# Altium schematic sheet EVK-IRIS-W1-MCULINK_USB_DCDC.SchDoc
size A3; DocumentNumber: 8; SheetNumber: 8; SheetTotal: 14
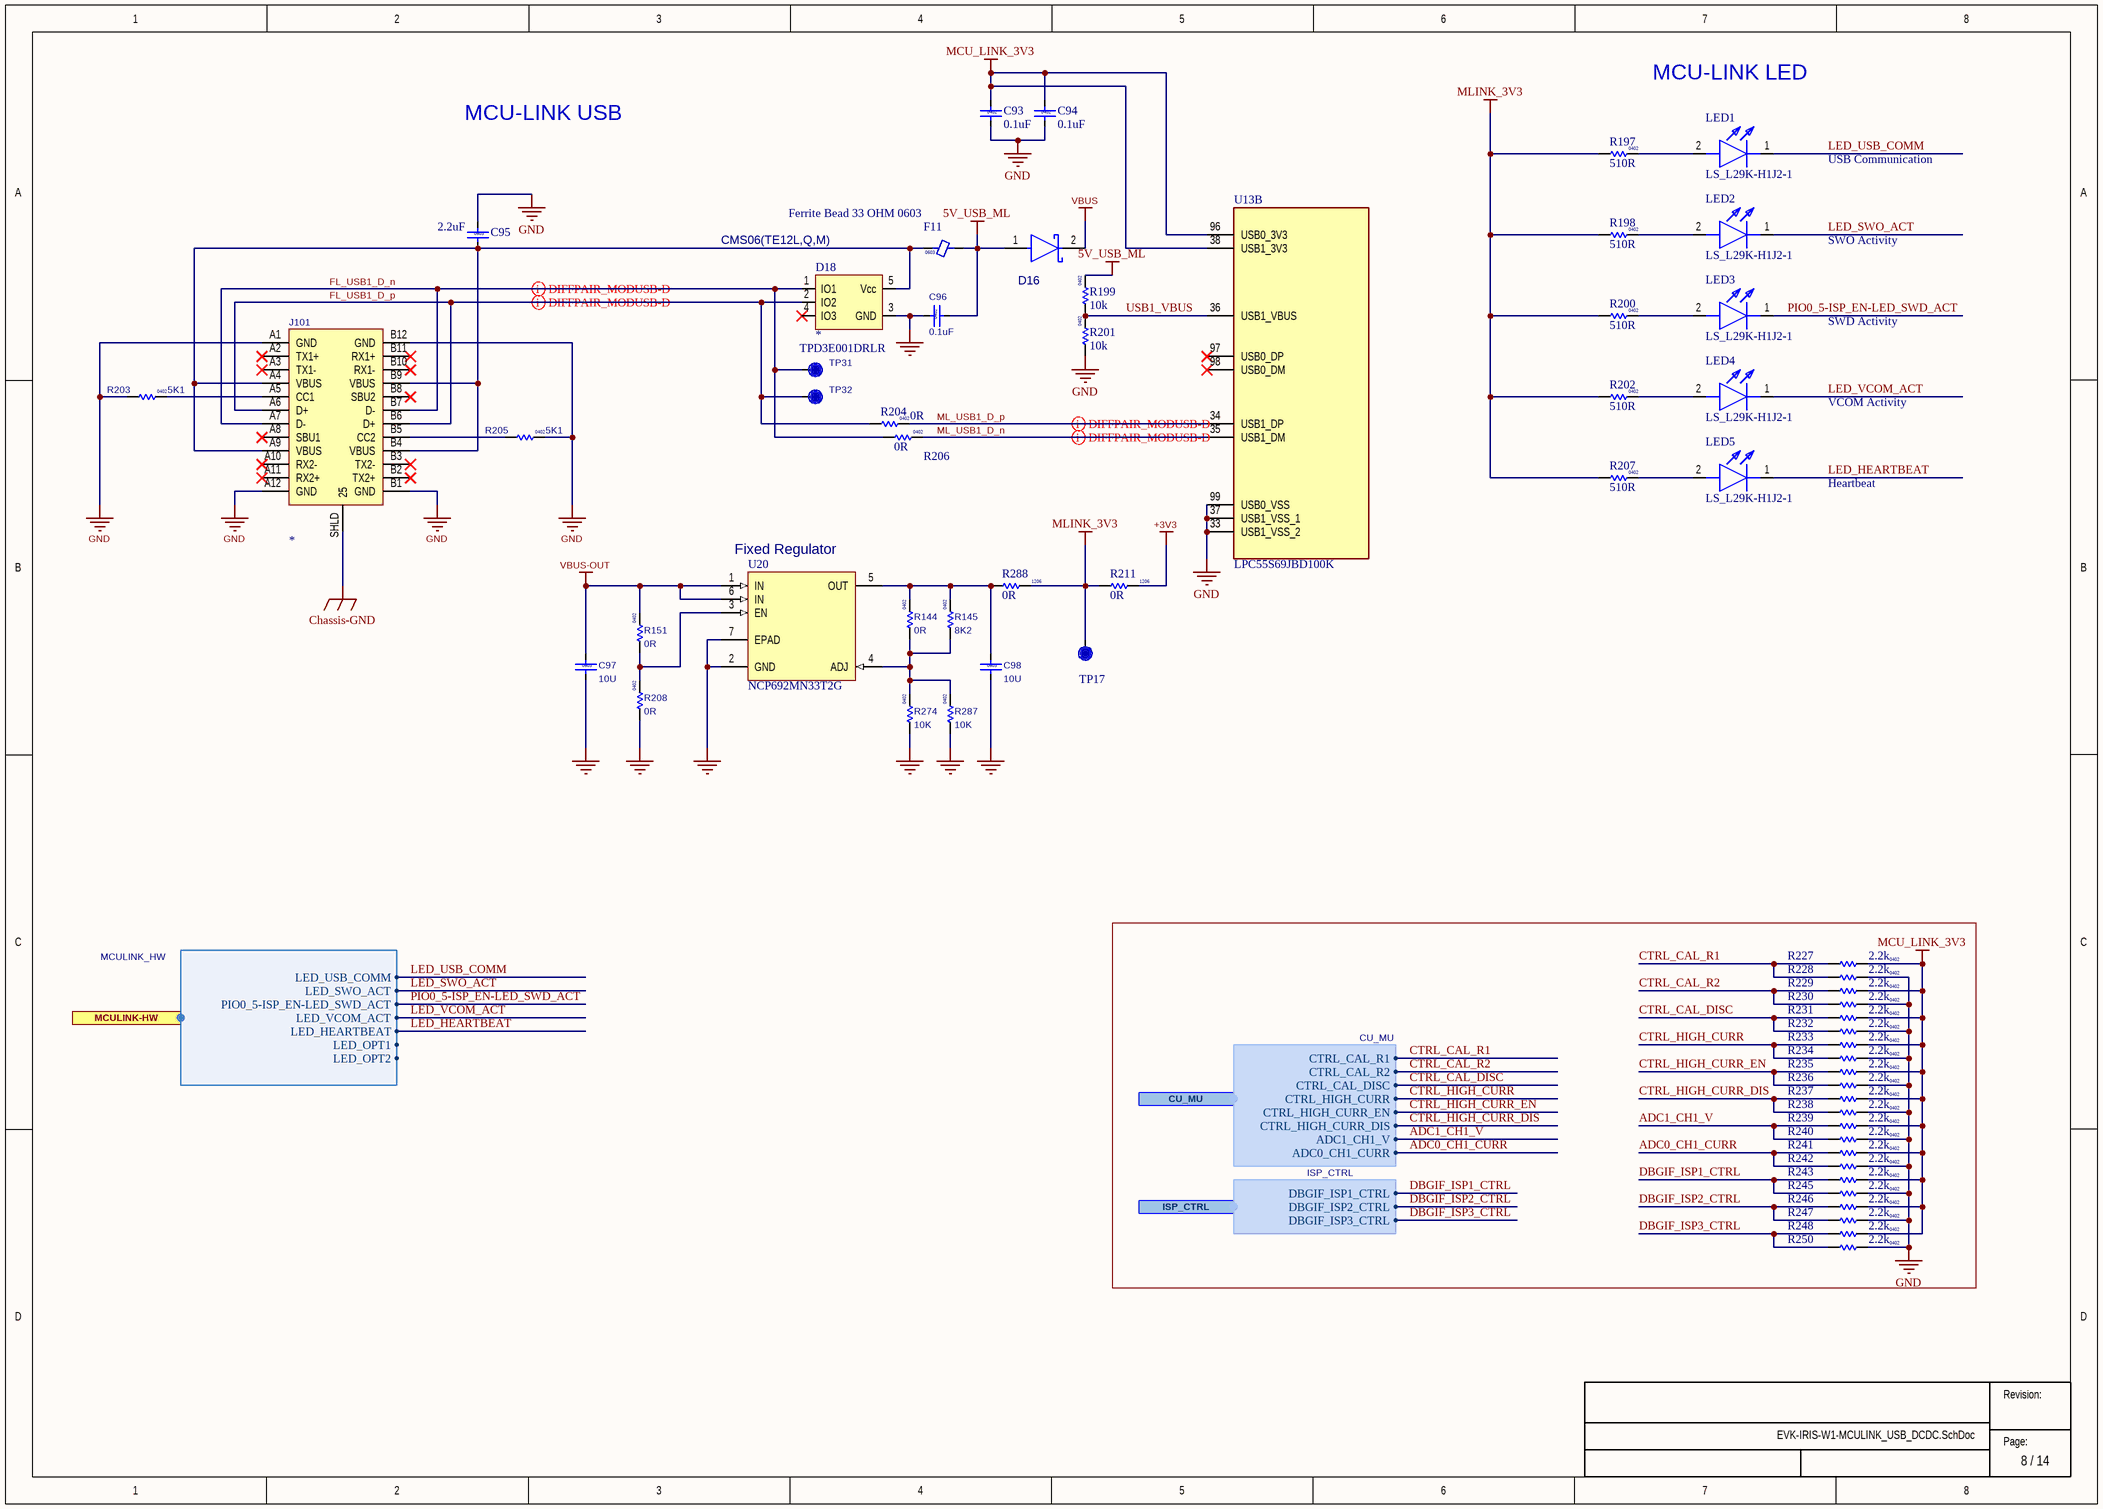
[diagram p0: EVK-IRIS-W1-MCULINK_USB_DCDC.SchDoc]

## Parts
C93  value 0.1uF  Size: 0402  [Cap 0402 HD]
C94  value 0.1uF  Size: 0402  [Cap 0402 HD]
C95  value 2.2uF  Size: 0603  [Cap 0603 HD]
C96  value 0.1uF  Size: 0402  [Cap 0402 HD]  (hidden comment: 120-000160.1uF)
C97  value 10U  Size: 0603  [Cap 0603 HD]
C98  value 10U  Size: 0603  [Cap 0603 HD]
D16  CMS06(TE12L,Q,M)  [FP-M-FLAT-MFG]
D18  Manufacturer Part Number 1: TPD3E001DRLR  [SOT-553]
F11  Size: 0603  Part Name: Ferrite Bead 33 OHM 0603  [IND 0603]
J101  (no value)  [CON_USB-C-RA_W-6Tabs]
LED1  LS_L29K-H1J2-1  [SMT-0603]
LED2  LS_L29K-H1J2-1  [SMT-0603]
LED3  LS_L29K-H1J2-1  [SMT-0603]
LED4  LS_L29K-H1J2-1  [SMT-0603]
LED5  LS_L29K-H1J2-1  [SMT-0603]
R144  value 0R  Size: 0402  [RES 0402 HD]
R145  value 8K2  Size: 0402  [RES 0402 HD]
R151  value 0R  Size: 0402  [RES 0402 HD]
R197  value 510R  Size: 0402  [RES 0402 HD]
R198  value 510R  Size: 0402  [RES 0402 HD]
R199  value 10k  Size: 0402  [RES 0402 HD]
R200  value 510R  Size: 0402  [RES 0402 HD]
R201  value 10k  Size: 0402  [RES 0402 HD]
R202  value 510R  Size: 0402  [RES 0402 HD]
R203  value 5K1  Size: 0402  [RES 0402 HD]
R204  value 0R  Size: 0402  [RES 0402 HD]
R205  value 5K1  Size: 0402  [RES 0402 HD]
R206  value 0R  Size: 0402  [RES 0402 HD]
R207  value 510R  Size: 0402  [RES 0402 HD]
R208  value 0R  Size: 0402  [RES 0402 HD]
R211  value 0R  Size: 1206  [RES 1206]
R227  value 2.2k  Size: 0402  [RES 0402 HD]
R228  value 2.2k  Size: 0402  [RES 0402 HD]
R229  value 2.2k  Size: 0402  [RES 0402 HD]
R230  value 2.2k  Size: 0402  [RES 0402 HD]
R231  value 2.2k  Size: 0402  [RES 0402 HD]
R232  value 2.2k  Size: 0402  [RES 0402 HD]
R233  value 2.2k  Size: 0402  [RES 0402 HD]
R234  value 2.2k  Size: 0402  [RES 0402 HD]
R235  value 2.2k  Size: 0402  [RES 0402 HD]
R236  value 2.2k  Size: 0402  [RES 0402 HD]
R237  value 2.2k  Size: 0402  [RES 0402 HD]
R238  value 2.2k  Size: 0402  [RES 0402 HD]
R239  value 2.2k  Size: 0402  [RES 0402 HD]
R240  value 2.2k  Size: 0402  [RES 0402 HD]
R241  value 2.2k  Size: 0402  [RES 0402 HD]
R242  value 2.2k  Size: 0402  [RES 0402 HD]
R243  value 2.2k  Size: 0402  [RES 0402 HD]
R245  value 2.2k  Size: 0402  [RES 0402 HD]
R246  value 2.2k  Size: 0402  [RES 0402 HD]
R247  value 2.2k  Size: 0402  [RES 0402 HD]
R248  value 2.2k  Size: 0402  [RES 0402 HD]
R250  value 2.2k  Size: 0402  [RES 0402 HD]
R274  value 10K  Size: 0402  [RES 0402 HD]
R287  value 10K  Size: 0402  [RES 0402 HD]
R288  value 0R  Size: 1206  [RES 1206]
TP17  TP  [TP10R]  (value not drawn)
TP31  TP  [TP10R]  (value not drawn)  (no BOM)
TP32  TP  [TP10R]  (value not drawn)  (no BOM)
U13  LPC55S69JBD100K  [QFP50P1600X1600X160-101N]  (part B of 3)
U20  NCP692MN33T2G  [DFN-PSON.1P3X3-7pin_HS-7N]

## Ports
CU_MU (harness CU_MU), ISP_CTRL (harness ISP_CTRL), MCULINK-HW (harness MCULINK_HW)

## Harnesses
MCULINK_HW: LED_USB_COMM, LED_SWO_ACT, PIO0_5-ISP_EN-LED_SWD_ACT, LED_VCOM_ACT, LED_HEARTBEAT, LED_OPT1, LED_OPT2
CU_MU: CTRL_CAL_R1, CTRL_CAL_R2, CTRL_CAL_DISC, CTRL_HIGH_CURR, CTRL_HIGH_CURR_EN, CTRL_HIGH_CURR_DIS, ADC1_CH1_V, ADC0_CH1_CURR
ISP_CTRL: DBGIF_ISP1_CTRL, DBGIF_ISP2_CTRL, DBGIF_ISP3_CTRL

## Nets
5V_USB_ML: C96.2 D16.1(A) F11.1 R199.2
+3V3: R211.2
Chassis-GND: J101.SHLD(25)
GND: C93.2 C94.2 C95.1 C96.1 C97.2 C98.2 D18.3(GND) J101.A1(GND) J101.A12(GND) J101.B1(GND) J101.B12(GND) R201.1 R203.1 R205.2 R208.1 R228.1 R230.2 R232.1 R234.2 R236.1 R238.2 R240.1 R242.2 R245.1 R247.2 R250.1 R274.1 R287.1 U13.33(USB1_VSS_2) U13.37(USB1_VSS_1) U13.99(USB0_VSS) U20.2(GND) U20.7(EPAD)
MCU_LINK_3V3: C93.1 C94.1 R227.2 R229.2 R231.2 R233.2 R235.2 R237.2 R239.2 R241.2 R243.2 R246.2 R248.2 U13.38(USB1_3V3) U13.96(USB0_3V3)
MLINK_3V3: R197.1 R198.1 R200.1 R202.1 R207.1 R211.1 R288.2 TP17.1
VBUS: D16.2(C)
VBUS-OUT: C97.1 R151.2 U20.1(IN) U20.6(IN)
ADC0_CH1_CURR: R241.1 R242.1 ; port CU_MU.ADC0_CH1_CURR
ADC1_CH1_V: R239.1 R240.2 ; port CU_MU.ADC1_CH1_V
CTRL_CAL_DISC: R231.1 R232.2 ; port CU_MU.CTRL_CAL_DISC
CTRL_CAL_R1: R227.1 R228.2 ; port CU_MU.CTRL_CAL_R1
CTRL_CAL_R2: R229.1 R230.1 ; port CU_MU.CTRL_CAL_R2
CTRL_HIGH_CURR: R233.1 R234.1 ; port CU_MU.CTRL_HIGH_CURR
CTRL_HIGH_CURR_DIS: R237.1 R238.1 ; port CU_MU.CTRL_HIGH_CURR_DIS
CTRL_HIGH_CURR_EN: R235.1 R236.2 ; port CU_MU.CTRL_HIGH_CURR_EN
DBGIF_ISP1_CTRL: R243.1 R245.2 ; port ISP_CTRL.DBGIF_ISP1_CTRL
DBGIF_ISP2_CTRL: R246.1 R247.1 ; port ISP_CTRL.DBGIF_ISP2_CTRL
DBGIF_ISP3_CTRL: R248.1 R250.2 ; port ISP_CTRL.DBGIF_ISP3_CTRL
FL_USB1_D_n: D18.1(IO1) J101.A7(D-) J101.B7(D-) R206.1 TP31.1
FL_USB1_D_p: D18.2(IO2) J101.A6(D+) J101.B6(D+) R204.1 TP32.1
LED_HEARTBEAT: LED5.1(K) ; port MCULINK-HW.LED_HEARTBEAT
LED_SWO_ACT: LED2.1(K) ; port MCULINK-HW.LED_SWO_ACT
LED_USB_COMM: LED1.1(K) ; port MCULINK-HW.LED_USB_COMM
LED_VCOM_ACT: LED4.1(K) ; port MCULINK-HW.LED_VCOM_ACT
ML_USB1_D_n: R206.2 U13.35(USB1_DM)
ML_USB1_D_p: R204.2 U13.34(USB1_DP)
PIO0_5-ISP_EN-LED_SWD_ACT: LED3.1(K) ; port MCULINK-HW.PIO0_5-ISP_EN-LED_SWD_ACT
USB1_VBUS: R199.1 R201.2 U13.36(USB1_VBUS)
NetC95_2: C95.2 D18.5(Vcc) F11.2 J101.A4(VBUS) J101.A9(VBUS) J101.B4(VBUS) J101.B9(VBUS)
NetC98_1: C98.1 R144.2 R145.2 R288.1 U20.5(OUT)
NetJ101_A5: J101.A5(CC1) R203.2
NetJ101_B5: J101.B5(CC2) R205.1
NetLED1_2: LED1.2(A) R197.2
NetLED2_2: LED2.2(A) R198.2
NetLED3_2: LED3.2(A) R200.2
NetLED4_2: LED4.2(A) R202.2
NetLED5_2: LED5.2(A) R207.2
NetR144_1: R144.1 R145.1 R274.2 R287.2 U20.4(ADJ)
NetR151_1: R151.1 R208.2 U20.3(EN)

Not connected (* = marked no-connect by the designer): D18 4(IO3)*; J101 A2(TX1+)* A3(TX1-)* A8(SBU1)* A10(RX2-)* A11(RX2+)* B2(TX2+)* B3(TX2-)* B8(SBU2)* B10(RX1-)* B11(RX1+)*; U13 97(USB0_DP)* 98(USB0_DM)*

## Layout directives
differential pair; differential pair class USB_DIFF; net class USB_DIFF: FL_USB1_D_n, FL_USB1_D_p, ML_USB1_D_n, ML_USB1_D_p

## Notes on the sheet
- MCU-LINK LED
- MCU-LINK USB
- USB Communication
- SWO Activity
- SWD Activity
- VCOM Activity
- Heartbeat
- (near U20) Fixed Regulator
- Revision:
- Page:

## Library data of the parts
C93 C94 = 120-00016: Cap, Ceramic 0.1uF 10V 10% X5R 0402; Manufacturer 1: Murata Electronics North America; Manufacturer Part Number 1: GRM155R61A104KA01J; Part Name: CAP CER 0.1UF 10V 10% X5R 0402; Item Phase: In Production; Tolerance: +/- 10%; Use in new designs: Yes; UBX Code: None; Part Number: 120-00016; Supplier 1: Digi-Key; Supplier Part Number 1: 490-6297-1-ND; Manufacturer 2: Yageo; Manufacturer Part Number 2: CC0402KRX5R6BB104; Supplier 2: Digi-Key; Supplier Part Number 2: 311-1336-1-ND; Height: 0.55mm; Max Operating Temp: 85; Min Operating Temp: -55; Pins: 2; Revision: 0A; Temperature Coefficient: X5R; Voltage: 10V
C95 = 120-00004: Cap, Ceramic 2.2uF 10V 10% X5R 0603; Manufacturer 1: Yageo; Manufacturer Part Number 1: CC0603KRX5R6BB225; Part Name: CAP CER 2.2UF 10V 10% X5R 0603; Item Phase: In Production; Tolerance: +/- 10%; Use in new designs: Yes; UBX Code: None; Part Number: 120-00004; Supplier 1: Digi-Key; Supplier Part Number 1: 311-1451-1-ND; Manufacturer 2: Samsung Electro-Mechanics America, Inc; Manufacturer Part Number 2: CL10A225KP8NNNC; Supplier 2: Digi-Key; Supplier Part Number 2: 1276-1085-1-ND; Height: 0.9mm; Max Operating Temp: 85; Min Operating Temp: -55; Pins: 2; Revision: 0A; Temperature Coefficient: X5R; Voltage: 10V
C96 = 120-00016: Cap, Ceramic 0.1uF 10V 10% X5R 0402; Part Name: CAP CER 0.1UF 10V 10% X5R 0402; Part_Type: Ceramic Capacitor; Manufacturer: Murata Electronics North America; Manufacturer P/N: GRM155R61A104KA01J; Item_Phase: Production; Component Mounting Type: SMT; Tolerance: +/- 10%; Use in new designs: Yes; Part Number: 120-00016; Revision: 0A; Supplier 1: Digi-Key; Supplier Part Number 1: 490-6297-1-ND; Manufacturer 2: Yageo; Manufacturer P/N 2: CC0402KRX5R6BB104; Supplier 2: Digi-Key; Supplier Part Number 2: 311-1336-1-ND; Arena Link: https://app.bom.com/a/GYHPV2L2L43KRMBK?v=spec.summary; Height: 0.55mm; Pins: 2; Temperature Coefficient: X5R; Voltage: 10V
C97 C98 = UBXH01-0000310: CAP CER X7R 0603 10U 20% 10V; Manufacturer: Murata Manufacturing Company, Ltd.; Manufacturer P/N: GRM188Z71A106MA73; Editor: michael.hein; Released by: martin.grasse; Env: ROHS; Permitted Use: Volume Products; Perferred: PREF; Mfg P/N Status: Active; Mfg P/N Split: 100; Mfg P/N Released: Yes; Part Number: UBXH01-0000310; Tolerance: 20%; Max Voltage: 10V; Min Operating Temp: -55°C; Max Operating Temp: 125°C; Part Type: Capacitor; Release Data: 2017-02-09 11:14:05.871832; UBX Wiki: https://wiki.u-blox.com/bin/view/Operations/PartDetails?index=26280; RefDes: C; Mfg P/N Datasheet: https://wiki.u-blox.com/bin/view/Generic/Docs/DocumentSummary?index=26282; Manufacturer 2: Murata Manufacturing Company, Ltd.; Manufacturer P/N 2: GRM188Z71A106KA73; Mfg P/N Status 2: Active; Mfg P/N Split 2: 0; Mfg P/N Released 2: Yes; Mfg P/N Datasheet 2: https://wiki.u-blox.com/bin/view/Generic/Docs/DocumentSummary?index=28416
D16 = CMP-2000-06115-2: Diode Schottky 30 V 2A Surface Mount M-FLAT (2.4x3.8); Manufacturer: Toshiba; Forward Voltage: 370mV; Peak Non-Repetitive Surge Current: 40A; Max Repetitive Reverse Voltage (Vrrm): 30V; Max Reverse Leakage Current: 3mA; Element Configuration: Single; Package Quantity: 1; Max Operating Temperature: 125°C; Mount: Surface Mount; Forward Current: 2A; Number of Pins: 2; Min Operating Temperature: -40°C; Radiation Hardening: No; Average Rectified Current: 2A; Contact Plating: Tin; Max Reverse Voltage (DC): 30V; Peak Reverse Current: 3mA; Max Surge Current: 40A; Packaging: Tape and Reel; Manufacturer P/N: CMS06(TE12L,Q,M)
D18 = 110-00018: TVS Diode, ESD High Speed 3-Channel Array, SOT-553; Manufacturer 1: Texas Instruments; Part Name: Diode TVS 5V 3CH SOT-553; Body Size: 1.60mm x 1.20mm; Current: None; Item Phase: In Production; MFG Package: SOT-553, DRL (R-PDSO-N5); Use in new designs: Yes; Voltage: 5.5V; Manufacturer P/N: *; Part Number: 110-00018; Supplier 1: Digi-Key; Supplier Part Number 1: 296-21885-1-ND; Manufacturer 2: None; Manufacturer Part Number 2: None; Supplier 2: None; Supplier Part Number 2: None; Height: 0.60mm; Max Operating Temp: 85; Min Operating Temp: -40; Pins: 5; Revision: 0A; UBX Code: None
F11 = 155-00012: FERRITE BEAD 33 OHM 0603 1LN; Manufacturer 1: Murata Electronics North America; Manufacturer Part Number 1: BLM18PG330SN1D; Body Size: 1.60mm x 0.80mm; Current: 3A; Item Phase: Pre-Production; Use in new designs: Yes; Value: None; Part Number: 155-00012; Supplier 1: Digi-Key; Supplier Part Number 1: 490-5220-1-ND; Height: 0.95mm; MFG Package: 0603; Max Operating Temp: 125; Min Operating Temp: -55; Pins: 2; Revision: 1; Voltage: None; Manufacturer 2: None; Manufacturer Part Number 2: None; Supplier 2: None; Supplier Part Number 2: None; UBX Code: None
J101 = 130-00150: Connector, USB-C Receptacle, 24 Position, Surface Mount, Right Angle, Horizontal, 20V; Manufacturer 1: JAE Electronics; Manufacturer Part Number 1: DX07S024JJ3R1300; Part Name: CON USB C 0.5 mm 24 Pin 2 Row Right Angle White; Item Phase: Unreleased; Use in new designs: Yes; UBX Code: None; Manufacturer P/N: *; Part Number: 130-00150; Supplier 1: Digi-Key; Supplier Part Number 1: 670-2846-1-ND; Diameter: None; Height: 3.29mm; Max Operating Temp: 80; Min Operating Temp: -30; Pins: 24; Revision: None; Voltage: 20V; Manufacturer 2: None; Manufacturer Part Number 2: None; Supplier 2: None; Supplier Part Number 2: None
LED1-LED5 = LS_L29K-H1J2-1: LED; Manufacturer_Name: OSRAM; Manufacturer_Part_Number: LS L29K-H1J2-1; Mouser Part Number: 720-LSL29K-H1J2-1-Z; Mouser Price/Stock: https://www.mouser.com/Search/Refine.aspx?Keyword=720-LSL29K-H1J2-1-Z
R144 R151 R204 R206 R208 = UBXH18-0003002: RES THICK FILM CHIP 0402 0R 0 100mW; Manufacturer: KOA; Manufacturer P/N: RK73Z1ETTD; Tolerance: 0; Editor: charlotte.biber; Released by: peter.mueller; Env: ROHS; Permitted Use: Volume Products; Perferred: PREF; Mfg P/N Status: NRND; Mfg P/N Split: 100; Mfg P/N Released: Yes; Part Number: UBXH18-0003002; Max Power: 100mW; Part Type: Resistor; UBX Wiki: https://wiki.u-blox.com/bin/view/Operations/PartDetails?index=6611; RefDes: R; Manufacturer 2: YAGEO; Manufacturer P/N 2: 2322_705_91001_L; Mfg P/N Status 2: NRND; Mfg P/N Split 2: 0; Mfg P/N Released 2: Yes
  R144 R151 R208: Release Data: 2012-06-05 09:49:55.978616
  R204 R206: Release Data: 2012-06-05T09:49:55
R145 = UBXH18-0000138: RES THICK FILM CHIP 0402 8K2 1% 63mW; Manufacturer: Vishay; Manufacturer P/N: CRCW04028K20FKED; Editor: matej.budin; Released by: pasquale.scorca; Env: ROHS; Permitted Use: Support Products; Perferred: PREF; Mfg P/N Status: Active; Mfg P/N Split: 100; Mfg P/N Released: Yes; Part Number: UBXH18-0000138; Tolerance: 1%; Max Power: 63mW; Min Operating Temp: -55°C; Max Operating Temp: 125°C; Part Type: Resistor; Release Data: 2014-08-26 11:33:33.796911; UBX Wiki: https://wiki.u-blox.com/bin/view/Operations/PartDetails?index=21078; RefDes: R; Mfg P/N Datasheet: https://wiki.u-blox.com/bin/view/Generic/Docs/DocumentSummary?index=21077
R197 R198 R200 R202 R207 = UBXH18-0008042: RES THICK FILM CHIP 0402 510R 5% 100mW; Manufacturer: YAGEO; Manufacturer P/N: 2322_705_87511_L; Editor: peter.mueller; Env: ROHS; Permitted Use: Internal Use; Perferred: NONPREF; Mfg P/N Status: NRND; Mfg P/N Split: 100; Mfg P/N Released: No; Part Number: UBXH18-0008042; Tolerance: 5%; Max Power: 100mW; Part Type: Resistor; UBX Wiki: https://wiki.u-blox.com/bin/view/Operations/PartDetails?index=6930; RefDes: R
R199 R201 = 180-00024: Resistor 10k ohm 1% 1/16W, 0402; Manufacturer 1: Samsung Electro-Mechanics America, Inc; Manufacturer Part Number 1: RC1005F103CS; Part Name: RES SMD 10K OHM 1% 1/16W 0402; Item Phase: In Production; Tolerance: +/- 1%; Use in new designs: Yes; UBX Code: None; Part Number: 180-00024; Supplier 1: Digi-Key; Supplier Part Number 1: 1276-3431-1-ND; Manufacturer 2: Hong Kong Resistors Manufactory; Manufacturer Part Number 2: RCT0210KFLF; Supplier 2: None; Supplier Part Number 2: None; Height: 0.4mm; Max Operating Temp: 155; Min Operating Temp: -55; Pins: 2; Power: 1/16W; Revision: 0E; Voltage: N/A
R203 R205 = UBXH18-0008066: RES THICK FILM CHIP 0402 5K1 5% 100mW; Manufacturer: Panasonic; Manufacturer P/N: ERJ-2GEJ512X; Editor: alvaro.nussbaum; Released by: roland.rust; Env: ROHS; Permitted Use: Internal Use; Perferred: NONPREF; Mfg P/N Status: Active; Mfg P/N Split: 100; Mfg P/N Released: No; Part Number: UBXH18-0008066; Tolerance: 5%; Max Power: 100mW; Part Type: Resistor; Release Data: 2016-02-11T15:22:01; UBX Wiki: https://wiki.u-blox.com/bin/view/Operations/PartDetails?index=6972; RefDes: R
R211 R288 = UBXH18-0000020: RES THICK FILM CHIP 1206 0R 0 2A; Manufacturer: KOA; Manufacturer P/N: RK73Z2BT; Tolerance: 0; Editor: massimo.vlacci; Released by: erian.bezhani; Env: ROHS; Permitted Use: Support Products; Perferred: PREF; Mfg P/N Status: NRND; Mfg P/N Split: 100; Mfg P/N Released: Yes; Part Number: UBXH18-0000020; Max Current: 2A; Min Operating Temp: -55°C; Max Operating Temp: 125°C; Part Type: Resistor; Release Data: 2010-03-15T11:02:19; UBX Wiki: https://wiki.u-blox.com/bin/view/Operations/PartDetails?index=8587; RefDes: R; Mfg P/N Datasheet: https://wiki.u-blox.com/bin/view/Generic/Docs/DocumentSummary?index=8616
R227-R243 R245-R248 R250 = 180-00023: Resistor, 2.2Kohm, 1%, 1/16W, 0402; Manufacturer 1: Rohm Semiconductor; Manufacturer Part Number 1: MCR01MRTF2201; Part Name: RES SMD 2.2K OHM 1% 1/16W 0402; Item Phase: In Production; Tolerance: +/- 1%; Use in new designs: Yes; Voltage: None; Part Number: 180-00023; Supplier 1: Digi-Key; Supplier Part Number 1: RHM2.20KCDCT-ND; Manufacturer 2: Yageo; Manufacturer Part Number 2: RC0402FR-072K2L; Supplier 2: Digi-Key; Supplier Part Number 2: 311-2.20KLRCT-ND; Height: 0.4mm; Max Operating Temp: 155; Min Operating Temp: -55; Pins: 2; Power: 1/16W; Revision: 0A; UBX Code: None
R274 R287 = UBXH18-0000065: RES THICK FILM CHIP 0402 10K 1% 63mW; Manufacturer: KOA; Manufacturer P/N: RK73H1ETTP1002F; Editor: erian.bezhani; Released by: massimo.vlacci; Env: ROHS; Permitted Use: Volume Products; Perferred: PREF; Mfg P/N Status: Active; Mfg P/N Split: 100; Mfg P/N Released: Yes; Part Number: UBXH18-0000065; Tolerance: 1%; Max Power: 63mW; Part Type: Resistor; Release Data: 2012-06-08 18:02:21.521517; UBX Wiki: https://wiki.u-blox.com/bin/view/Operations/PartDetails?index=16837; RefDes: R; Mfg P/N Datasheet: https://wiki.u-blox.com/bin/view/Generic/Docs/DocumentSummary?index=8222
TP17 TP31 TP32 = TP10R: Testpoint, Round 1.0mm Dia; Added By: Jeremy D; Part Number: TP10R; Size: 1.0mm; Height: 0; DNP: DNP; Checked By: Paul B
  TP17: Added Date: 2015-02-01; Checked Date: 2015-02-05
  TP31 TP32: Added Date: 2/1/2015; Checked Date: 2/5/2015
U13 = LPC55S69JBD100K: NXP - LPC55S69JBD100K - MCU, 32BIT, 100MHZ, HLQFP; Geometry.Height: 1.6mm; Manufacturer_Name: NXP; Manufacturer_Part_Number: LPC55S69JBD100K; Mouser Part Number: 771-LPC55S69JBD100K; Mouser Price/Stock: https://www.mouser.co.uk/ProductDetail/NXP-Semiconductors/LPC55S69JBD100K?qs=0lSvoLzn4L8rE5nEAmBIGw%3D%3D; Arrow Part Number: LPC55S69JBD100K; Arrow Price/Stock: https://www.arrow.com/en/products/lpc55s69jbd100k/nxp-semiconductors?region=nac; Datasheet Link: https://au.mouser.com/datasheet/2/302/LPC55S6x-1536969.pdf
U20 = UBXH12-0000459: LOW DROPOUT REGULATOR ON SEMICONDUCTOR NCP692MN33T2G 6DFN 3.3V 6V 1A; Editor: hakan.ekfors; Released by: markus.wejrot; Env: ROHS; Permitted Use: Volume Products; Perferred: PREF; Mfg P/N Status: Active; Mfg P/N Split: 100; Mfg P/N Released: Yes; Part Number: UBXH12-0000459; Value: 3.3V; Max Voltage: 6V; Max Current: 1A; Min Operating Temp: -40°C; Max Operating Temp: 125°C; Part Type: Regulator; Release Data: 2021-08-23T15:14:48; UBX Wiki: https://wiki.u-blox.com/bin/view/Operations/PartDetails?index=35423; RefDes: U; Manufacturer: ON Semiconductor; Manufacturer P/N: NCP692MN33T2G; Mfg P/N Datasheet: https://wiki.u-blox.com/bin/view/Generic/Docs/DocumentSummary?index=35425